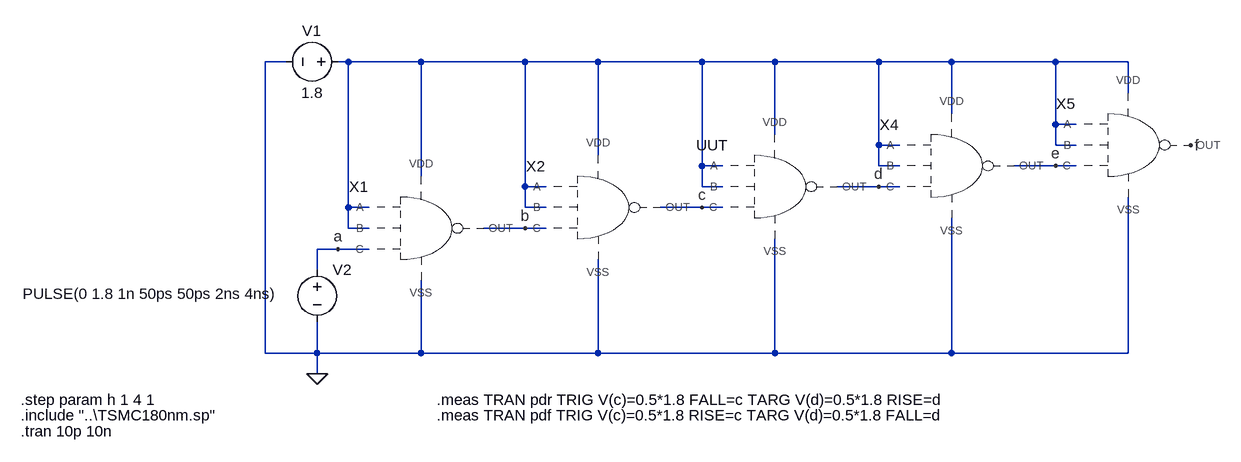
[diagram p0: schematic Problem_5-Logical_Effort.asc]
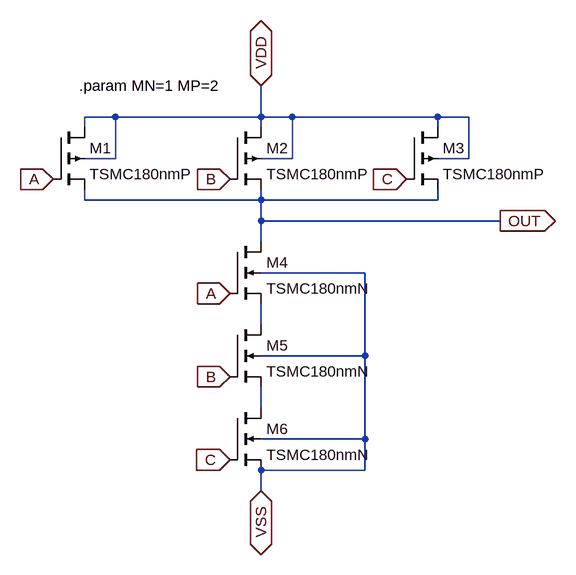
[diagram p1: sub-circuit nand3.asc]
Problem_5-Logical_Effort.asc, the LTspice schematic file:
Version 4
SHEET 1 1784 680
WIRE 144 -128 112 -128
WIRE 240 -128 224 -128
WIRE 352 -128 240 -128
WIRE 512 -128 352 -128
WIRE 624 -128 512 -128
WIRE 784 -128 624 -128
WIRE 896 -128 784 -128
WIRE 1056 -128 896 -128
WIRE 1168 -128 1056 -128
WIRE 1328 -128 1168 -128
WIRE 1440 -128 1328 -128
WIRE 1440 -80 1440 -128
WIRE 1168 -48 1168 -128
WIRE 1328 -32 1328 -128
WIRE 1360 -32 1328 -32
WIRE 896 -16 896 -128
WIRE 1056 0 1056 -128
WIRE 1088 0 1056 0
WIRE 1328 0 1328 -32
WIRE 1360 0 1328 0
WIRE 624 16 624 -128
WIRE 784 32 784 -128
WIRE 816 32 784 32
WIRE 1056 32 1056 0
WIRE 1088 32 1056 32
WIRE 1328 32 1264 32
WIRE 1360 32 1328 32
WIRE 352 48 352 -128
WIRE 512 64 512 -128
WIRE 544 64 512 64
WIRE 784 64 784 32
WIRE 816 64 784 64
WIRE 1056 64 992 64
WIRE 1088 64 1056 64
WIRE 240 96 240 -128
WIRE 272 96 240 96
WIRE 512 96 512 64
WIRE 544 96 512 96
WIRE 784 96 720 96
WIRE 816 96 784 96
WIRE 240 128 240 96
WIRE 272 128 240 128
WIRE 512 128 448 128
WIRE 544 128 512 128
WIRE 224 160 192 160
WIRE 272 160 224 160
WIRE 192 192 192 160
WIRE 112 320 112 -128
WIRE 192 320 192 272
WIRE 192 320 112 320
WIRE 352 320 352 208
WIRE 352 320 192 320
WIRE 624 320 624 176
WIRE 624 320 352 320
WIRE 896 320 896 144
WIRE 896 320 624 320
WIRE 1168 320 1168 112
WIRE 1168 320 896 320
WIRE 1440 320 1440 80
WIRE 1440 320 1168 320
WIRE 192 352 192 320
FLAG 224 160 a
FLAG 192 352 0
FLAG 512 128 b
FLAG 784 96 c
FLAG 1056 64 d
FLAG 1328 32 e
FLAG 1536 0 f
SYMBOL voltage 240 -128 R90
WINDOW 0 -32 56 VBottom 2
WINDOW 3 32 56 VTop 2
WINDOW 123 0 0 Left 0
WINDOW 39 0 0 Left 0
SYMATTR InstName V1
SYMATTR Value 1.8
SYMBOL voltage 192 176 R0
WINDOW 3 -453 53 Left 2
WINDOW 123 0 0 Left 0
WINDOW 39 0 0 Left 0
SYMATTR Value PULSE(0 1.8 1n 50ps 50ps 2ns 4ns)
SYMATTR InstName V2
SYMBOL NAND3 272 128 R0
WINDOW 0 -16 -48 Bottom 2
SYMATTR InstName X1
SYMATTR SpiceLine MP=1 MN=1
SYMBOL NAND3 544 96 R0
WINDOW 0 -16 -48 Bottom 2
SYMATTR InstName X2
SYMATTR SpiceLine MP=2*h MN=h
SYMBOL NAND3 816 64 R0
WINDOW 0 -16 -48 Bottom 2
SYMATTR InstName UUT
SYMATTR SpiceLine MP=2*h*h MN=h*h
SYMBOL NAND3 1088 32 R0
WINDOW 0 -16 -48 Bottom 2
SYMATTR InstName X4
SYMATTR SpiceLine MP=2*h*h*h MN=h*h*h
SYMBOL NAND3 1360 0 R0
WINDOW 0 -16 -48 Bottom 2
SYMATTR InstName X5
SYMATTR SpiceLine MP=2*h*h*h*h MN=h*h*h*h
TEXT -264 416 Left 2 !.include "..\\TSMC180nm.sp"
TEXT -264 440 Left 2 !.tran 10p 10n
TEXT -264 392 Left 2 !.step param h 1 4 1
TEXT 376 392 Left 2 !.meas TRAN pdr TRIG V(c)=0.5*1.8 FALL=c TARG V(d)=0.5*1.8 RISE=d
TEXT 376 416 Left 2 !.meas TRAN pdf TRIG V(c)=0.5*1.8 RISE=c TARG V(d)=0.5*1.8 FALL=d

nand3.asc, the sub-circuit schematic file:
Version 4
SHEET 1 1052 744
WIRE 352 64 304 64
WIRE 576 64 576 16
WIRE 576 64 352 64
WIRE 624 64 576 64
WIRE 848 64 624 64
WIRE 896 64 848 64
WIRE 304 80 304 64
WIRE 576 80 576 64
WIRE 848 80 848 64
WIRE 352 128 352 64
WIRE 352 128 304 128
WIRE 624 128 624 64
WIRE 624 128 576 128
WIRE 896 128 896 64
WIRE 896 128 848 128
WIRE 304 192 304 176
WIRE 576 192 576 176
WIRE 576 192 304 192
WIRE 848 192 848 176
WIRE 848 192 576 192
WIRE 576 224 576 192
WIRE 944 224 576 224
WIRE 576 256 576 224
WIRE 736 304 576 304
WIRE 576 384 576 352
WIRE 736 432 736 304
WIRE 736 432 576 432
WIRE 576 512 576 480
WIRE 736 560 736 432
WIRE 736 560 576 560
WIRE 736 608 736 560
WIRE 736 608 576 608
WIRE 576 640 576 608
FLAG 256 160 A
IOPIN 256 160 In
FLAG 944 224 OUT
IOPIN 944 224 Out
FLAG 576 640 VSS
IOPIN 576 640 BiDir
FLAG 576 16 VDD
IOPIN 576 16 BiDir
FLAG 528 160 B
IOPIN 528 160 In
FLAG 800 160 C
IOPIN 800 160 In
FLAG 528 336 A
IOPIN 528 336 In
FLAG 528 464 B
IOPIN 528 464 In
FLAG 528 592 C
IOPIN 528 592 In
SYMBOL nmos4 528 256 R0
SYMATTR InstName M4
SYMATTR Value TSMC180nmN
SYMATTR Value2 l=200nm w=1200nm ad=0 as=0 pd=0 ps=0 m={MN}
SYMBOL pmos4 256 80 R0
SYMATTR InstName M1
SYMATTR Value TSMC180nmP
SYMATTR Value2 l=200nm w=1200nm ad=0 as=0 pd=0 ps=0 m={MP}
SYMBOL pmos4 528 80 R0
SYMATTR InstName M2
SYMATTR Value TSMC180nmP
SYMATTR Value2 l=200nm w=1200nm ad=0 as=0 pd=0 ps=0 m={MP}
SYMBOL pmos4 800 80 R0
SYMATTR InstName M3
SYMATTR Value TSMC180nmP
SYMATTR Value2 l=200nm w=1200nm ad=0 as=0 pd=0 ps=0 m={MP}
SYMBOL nmos4 528 384 R0
SYMATTR InstName M5
SYMATTR Value TSMC180nmN
SYMATTR Value2 l=200nm w=1200nm ad=0 as=0 pd=0 ps=0 m={MN}
SYMBOL nmos4 528 512 R0
SYMATTR InstName M6
SYMATTR Value TSMC180nmN
SYMATTR Value2 l=200nm w=1200nm ad=0 as=0 pd=0 ps=0 m={MN}
TEXT 296 16 Left 2 !.param MN=1 MP=2

The netlist it stands for:
* Problem_5-Logical_Effort.asc
V1 N001 0 1.8
V2 a 0 PULSE(0 1.8 1n 50ps 50ps 2ns 4ns)
XX1 N001 b N001 0 a N001 nand3 params: MP=1 MN=1
XX2 N001 c N001 0 b N001 nand3 params: MP=2*h MN=h
XUUT N001 d N001 0 c N001 nand3 params: MP=2*h*h MN=h*h
XX4 N001 e N001 0 d N001 nand3 params: MP=2*h*h*h MN=h*h*h
XX5 N001 f N001 0 e N001 nand3 params: MP=2*h*h*h*h MN=h*h*h*h

* block symbol definitions
.subckt nand3 B OUT VDD VSS C A
M4 OUT A N001 VSS TSMC180nmN l=200nm w=1200nm ad=0 as=0 pd=0 ps=0 m={MN}
M1 VDD A OUT VDD TSMC180nmP l=200nm w=1200nm ad=0 as=0 pd=0 ps=0 m={MP}
M2 VDD B OUT VDD TSMC180nmP l=200nm w=1200nm ad=0 as=0 pd=0 ps=0 m={MP}
M3 VDD C OUT VDD TSMC180nmP l=200nm w=1200nm ad=0 as=0 pd=0 ps=0 m={MP}
M5 N001 B N002 VSS TSMC180nmN l=200nm w=1200nm ad=0 as=0 pd=0 ps=0 m={MN}
M6 N002 C VSS VSS TSMC180nmN l=200nm w=1200nm ad=0 as=0 pd=0 ps=0 m={MN}
.param MN=1 MP=2
.ends nand3

.model NMOS NMOS
.model PMOS PMOS
.lib standard.mos
.include "..\TSMC180nm.sp"
.tran 10p 10n
.step param h 1 4 1
.meas TRAN pdr TRIG V(c)=0.5*1.8 FALL=c TARG V(d)=0.5*1.8 RISE=d
.meas TRAN pdf TRIG V(c)=0.5*1.8 RISE=c TARG V(d)=0.5*1.8 FALL=d
.backanno
.end